# Altium project PCB_interplaque_PixhawkV2.PrjPcb
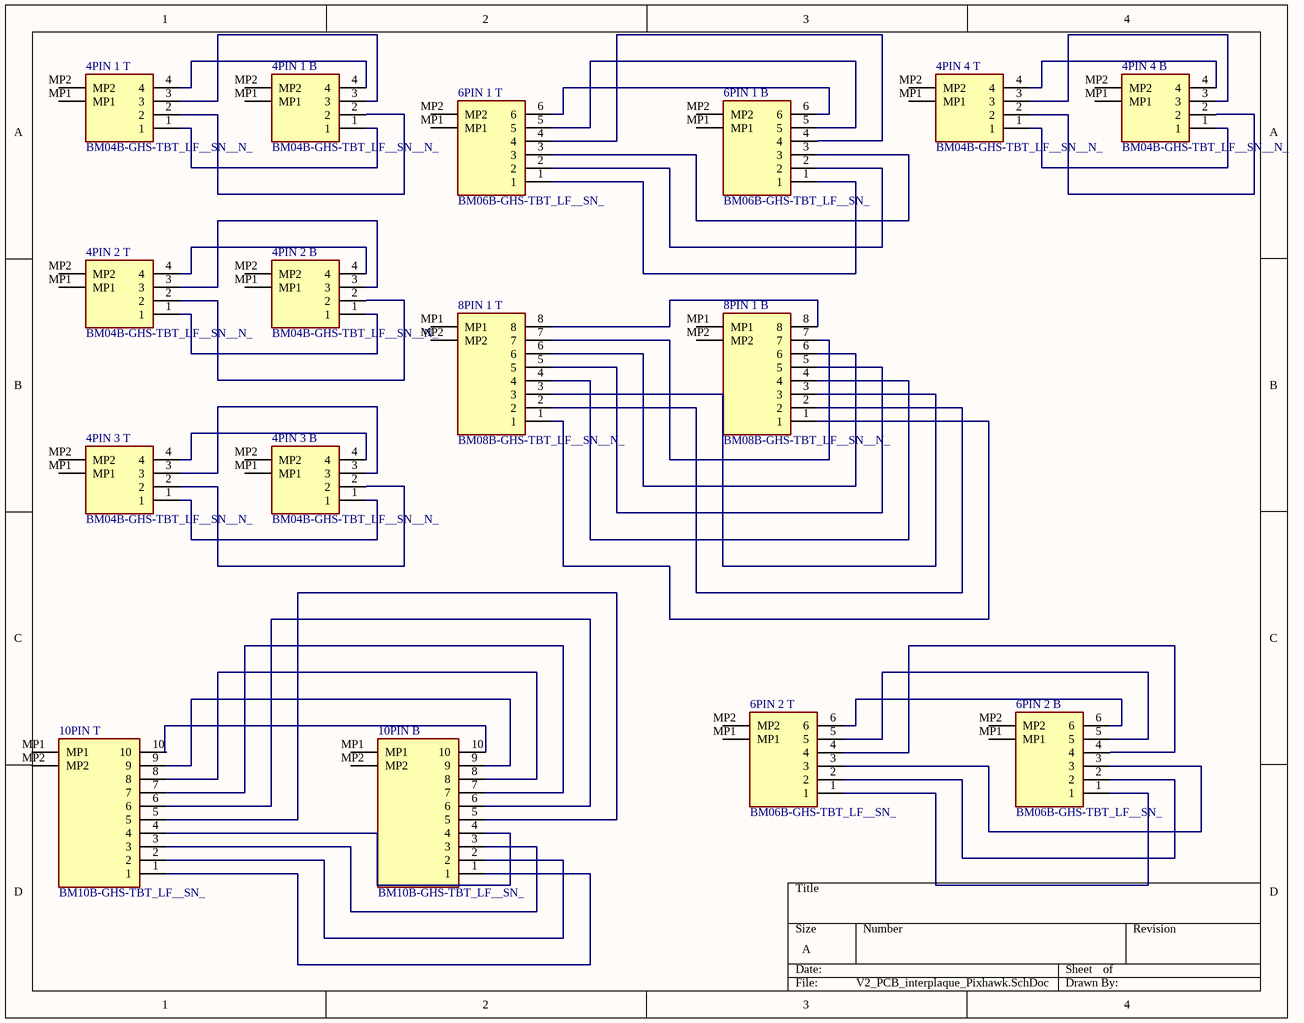
[diagram p0: V2_PCB_interplaque_Pixhawk.SchDoc]
1 sheet, 16 parts. Net scope: global (net labels, ports and power ports of the same name join across sheets).
Board file: V2_PCB_interplaque_PixhawkPcbDoc.PcbDoc

## Sheet V2_PCB_interplaque_Pixhawk.SchDoc
size A; SheetNumber: 1; SheetTotal: 1

### Parts
4PIN_1_B  BM04B-GHS-TBT_LF__SN__N_  [BM04BGHSTBTLFSNN]
4PIN_1_T  BM04B-GHS-TBT_LF__SN__N_  [BM04BGHSTBTLFSNN]
4PIN_2_B  BM04B-GHS-TBT_LF__SN__N_  [BM04BGHSTBTLFSNN]
4PIN_2_T  BM04B-GHS-TBT_LF__SN__N_  [BM04BGHSTBTLFSNN]
4PIN_3_B  BM04B-GHS-TBT_LF__SN__N_  [BM04BGHSTBTLFSNN]
4PIN_3_T  BM04B-GHS-TBT_LF__SN__N_  [BM04BGHSTBTLFSNN]
4PIN_4_B  BM04B-GHS-TBT_LF__SN__N_  [BM04BGHSTBTLFSNN]
4PIN_4_T  BM04B-GHS-TBT_LF__SN__N_  [BM04BGHSTBTLFSNN]
6PIN_1_B  BM06B-GHS-TBT_LF__SN_  [BM06BGHSTBTLFSN]
6PIN_1_T  BM06B-GHS-TBT_LF__SN_  [BM06BGHSTBTLFSN]
6PIN_2_B  BM06B-GHS-TBT_LF__SN_  [BM06BGHSTBTLFSN]
6PIN_2_T  BM06B-GHS-TBT_LF__SN_  [BM06BGHSTBTLFSN]
8PIN_1_B  BM08B-GHS-TBT_LF__SN__N_  [BM08BGHSTBTLFSNN]
8PIN_1_T  BM08B-GHS-TBT_LF__SN__N_  [BM08BGHSTBTLFSNN]
10PIN_B  BM10B-GHS-TBT_LF__SN_  [BM10BGHSTBTLFSN]
10PIN_T  BM10B-GHS-TBT_LF__SN_  [BM10BGHSTBTLFSN]

### Nets
Net4PIN_1_B_1: 4PIN_1_B.1 4PIN_1_T.1
Net4PIN_1_B_2: 4PIN_1_B.2 4PIN_1_T.2
Net4PIN_1_B_3: 4PIN_1_B.3 4PIN_1_T.3
Net4PIN_1_B_4: 4PIN_1_B.4 4PIN_1_T.4
Net4PIN_2_B_1: 4PIN_2_B.1 4PIN_2_T.1
Net4PIN_2_B_2: 4PIN_2_B.2 4PIN_2_T.2
Net4PIN_2_B_3: 4PIN_2_B.3 4PIN_2_T.3
Net4PIN_2_B_4: 4PIN_2_B.4 4PIN_2_T.4
Net4PIN_3_B_1: 4PIN_3_B.1 4PIN_3_T.1
Net4PIN_3_B_2: 4PIN_3_B.2 4PIN_3_T.2
Net4PIN_3_B_3: 4PIN_3_B.3 4PIN_3_T.3
Net4PIN_3_B_4: 4PIN_3_B.4 4PIN_3_T.4
Net4PIN_4_B_1: 4PIN_4_B.1 4PIN_4_T.1
Net4PIN_4_B_2: 4PIN_4_B.2 4PIN_4_T.2
Net4PIN_4_B_3: 4PIN_4_B.3 4PIN_4_T.3
Net4PIN_4_B_4: 4PIN_4_B.4 4PIN_4_T.4
Net6PIN_1_B_1: 6PIN_1_B.1 6PIN_1_T.1
Net6PIN_1_B_2: 6PIN_1_B.2 6PIN_1_T.2
Net6PIN_1_B_3: 6PIN_1_B.3 6PIN_1_T.3
Net6PIN_1_B_4: 6PIN_1_B.4 6PIN_1_T.4
Net6PIN_1_B_5: 6PIN_1_B.5 6PIN_1_T.5
Net6PIN_1_B_6: 6PIN_1_B.6 6PIN_1_T.6
Net6PIN_2_B_1: 6PIN_2_B.1 6PIN_2_T.1
Net6PIN_2_B_2: 6PIN_2_B.2 6PIN_2_T.2
Net6PIN_2_B_3: 6PIN_2_B.3 6PIN_2_T.3
Net6PIN_2_B_4: 6PIN_2_B.4 6PIN_2_T.4
Net6PIN_2_B_5: 6PIN_2_B.5 6PIN_2_T.5
Net6PIN_2_B_6: 6PIN_2_B.6 6PIN_2_T.6
Net8PIN_1_B_1: 8PIN_1_B.1 8PIN_1_T.1
Net8PIN_1_B_2: 8PIN_1_B.2 8PIN_1_T.2
Net8PIN_1_B_3: 8PIN_1_B.3 8PIN_1_T.3
Net8PIN_1_B_4: 8PIN_1_B.4 8PIN_1_T.4
Net8PIN_1_B_5: 8PIN_1_B.5 8PIN_1_T.5
Net8PIN_1_B_6: 8PIN_1_B.6 8PIN_1_T.6
Net8PIN_1_B_7: 8PIN_1_B.7 8PIN_1_T.7
Net8PIN_1_B_8: 8PIN_1_B.8 8PIN_1_T.8
Net10PIN_B_1: 10PIN_B.1 10PIN_T.1
Net10PIN_B_2: 10PIN_B.2 10PIN_T.2
Net10PIN_B_3: 10PIN_B.3 10PIN_T.3
Net10PIN_B_4: 10PIN_B.4 10PIN_T.4
Net10PIN_B_5: 10PIN_B.5 10PIN_T.5
Net10PIN_B_6: 10PIN_B.6 10PIN_T.6
Net10PIN_B_7: 10PIN_B.7 10PIN_T.7
Net10PIN_B_8: 10PIN_B.8 10PIN_T.8
Net10PIN_B_9: 10PIN_B.9 10PIN_T.9
Net10PIN_B_10: 10PIN_B.10 10PIN_T.10

Not connected (* = marked no-connect by the designer): 4PIN_1_B MP1 MP2; 4PIN_1_T MP1 MP2; 4PIN_2_B MP1 MP2; 4PIN_2_T MP1 MP2; 4PIN_3_B MP1 MP2; 4PIN_3_T MP1 MP2; 4PIN_4_B MP1 MP2; 4PIN_4_T MP1 MP2; 6PIN_1_B MP1 MP2; 6PIN_1_T MP1 MP2; 6PIN_2_B MP1 MP2; 6PIN_2_T MP1 MP2; 8PIN_1_B MP1 MP2; 8PIN_1_T MP1 MP2; 10PIN_B MP1 MP2; 10PIN_T MP1 MP2

### Library data of the parts
4PIN_1_B 4PIN_1_T 4PIN_2_B 4PIN_2_T 4PIN_3_B 4PIN_3_T 4PIN_4_B 4PIN_4_T = BM04B-GHS-TBT_LF__SN__N_: Connector; Manufacturer_Name: JST (JAPAN SOLDERLESS TERMINALS); Manufacturer_Part_Number: BM04B-GHS-TBT(LF)(SN)(N); Datasheet Link: http://www.jst-mfg.com/product/pdf/eng/eGH.pdf; Height: 4.05mm; Mouser Part Number: N/A; Mouser Price/Stock: https://www.mouser.co.uk/ProductDetail/JST-Commercial/BM04B-GHS-TBTLFSNN?qs=QpmGXVUTftGHKxacCgPJ1g%3D%3D; Arrow Part Number: BM04B-GHS-TBT(LF)(SN)(N); Arrow Price/Stock: https://www.arrow.com/en/products/bm04b-ghs-tbt-lf-sn-n/jst-manufacturing?region=europe
6PIN_1_B 6PIN_1_T 6PIN_2_B 6PIN_2_T = BM06B-GHS-TBT_LF__SN_: Connector; Manufacturer_Name: JST (JAPAN SOLDERLESS TERMINALS); Manufacturer_Part_Number: BM06B-GHS-TBT(LF)(SN); Datasheet Link: https://datasheet.lcsc.com/szlcsc/2004111131_JST-Sales-America-BM06B-GHS-TBT-LF-SN_C495534.pdf; Height: 4.05mm; Mouser Part Number: 306-BM06BGHSTBTLFSNN; Mouser Price/Stock: https://www.mouser.co.uk/ProductDetail/JST-Commercial/BM06B-GHS-TBTLFSN?qs=cdbOS8ANM9CObKjnhD04mw%3D%3D
8PIN_1_B 8PIN_1_T = BM08B-GHS-TBT_LF__SN__N_: Connector; Manufacturer_Name: JST (JAPAN SOLDERLESS TERMINALS); Manufacturer_Part_Number: BM08B-GHS-TBT(LF)(SN)(N); Datasheet Link: http://www.jst-mfg.com/product/pdf/eng/eGH.pdf; Height: 8mm; Arrow Part Number: BM08B-GHS-TBT(LF)(SN)(N); Arrow Price/Stock: https://www.arrow.com/en/products/bm08b-ghs-tbt-lf-sn-n/jst-manufacturing
10PIN_B 10PIN_T = BM10B-GHS-TBT_LF__SN_: Connector; Manufacturer_Name: JST (JAPAN SOLDERLESS TERMINALS); Manufacturer_Part_Number: BM10B-GHS-TBT(LF)(SN); Datasheet Link: https://www.jst-mfg.com/product/pdf/eng/eGH.pdf; Height: 4.05mm; Mouser Part Number: 306-BM10BGHSTBTLFSNN; Mouser Price/Stock: https://www.mouser.co.uk/ProductDetail/JST-Commercial/BM10B-GHS-TBTLFSN?qs=cdbOS8ANM9DbOgMfc5J99A%3D%3D